# EasyEDA Pro project ProProject_ReuleauxTriangle_2023-12-01.epro

# Schematic Schematic1
Create Date: 2023-11-23; Page Name: P1; Project Name: ReuleauxTriangle; Schematic Name: Schematic1; Update Date: 2023-11-29; Company: 嘉立创EDA; Page Size: A4; Version: V1.0
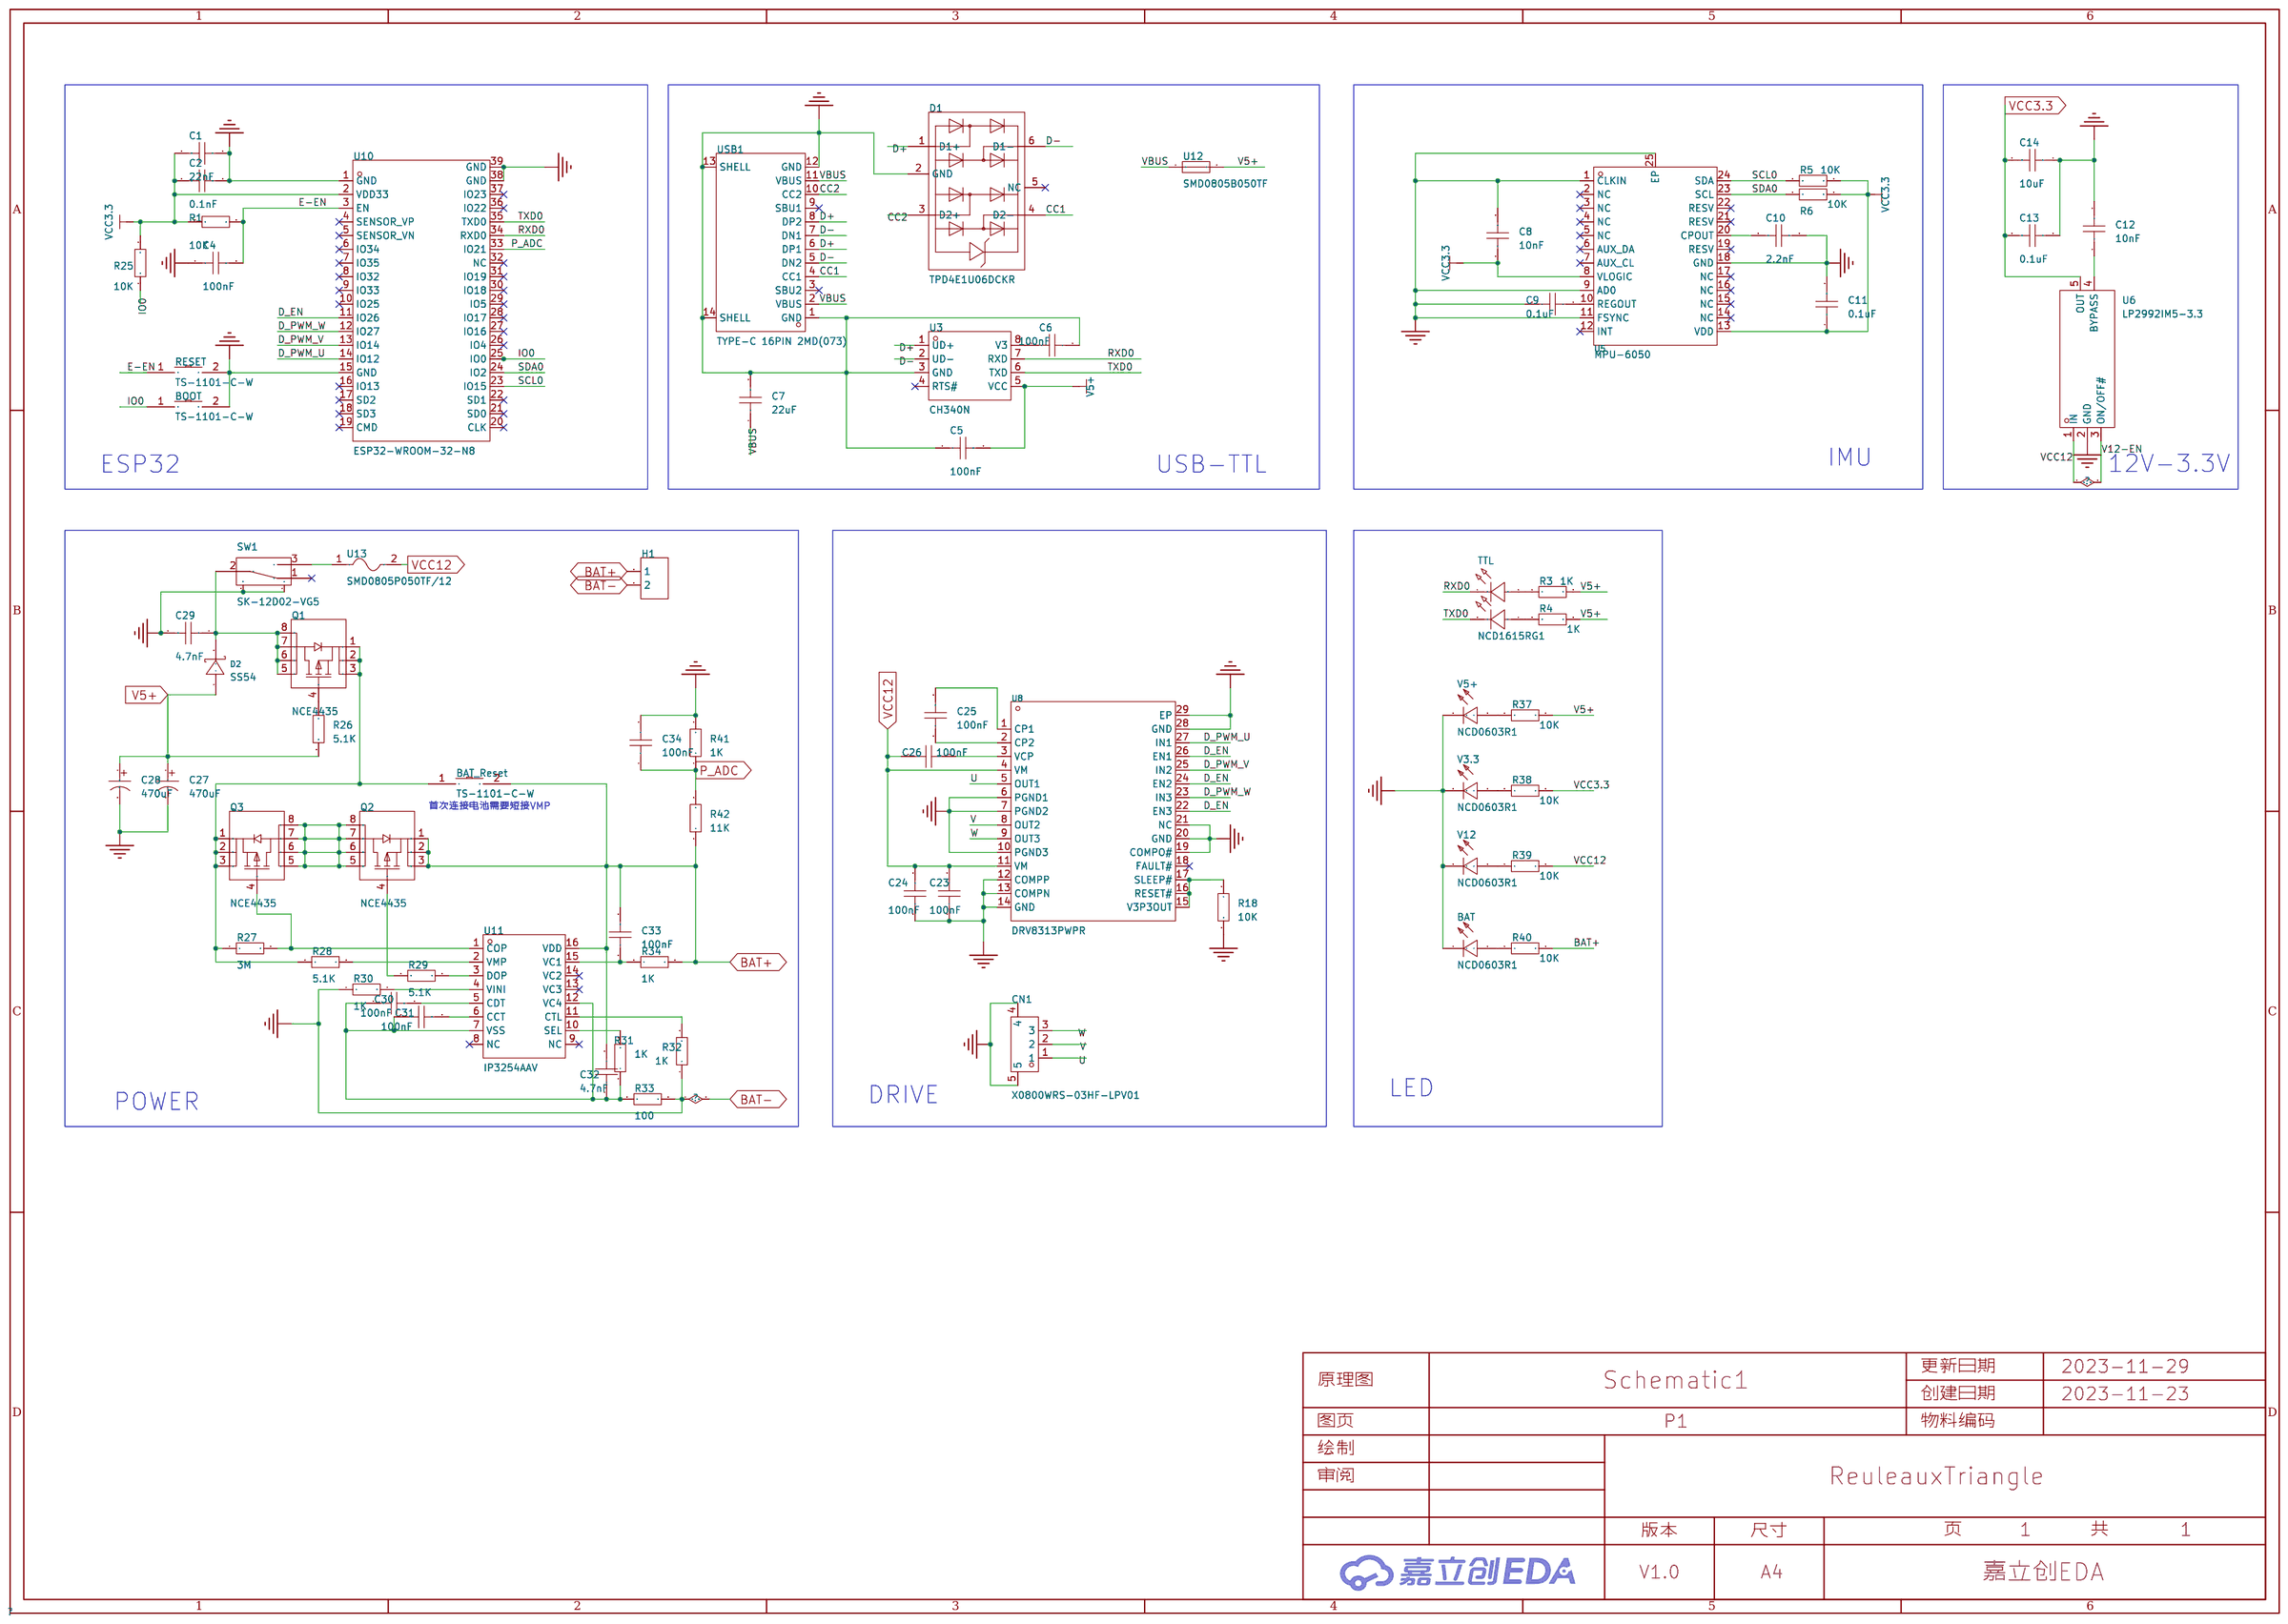
[diagram p0: schematic sheet]

## Parts
BAT  NCD0603R1  [LED0603-RD_RED]
BAT_Reset  TS-1101-C-W  [SW-SMD_L6.0-W3.3-LS8.0]
BOOT  TS-1101-C-W  [SW-SMD_L6.0-W3.3-LS8.0]
C1  22nF  [C0402]
C2  0.1nF  [C0402]
C4  100nF  [C0402]
C5  100nF  [C0402]
C6  100nF  [C0402]
C7  22uF  [C0402]
C8  10nF  [C0402]
C9  0.1uF  [C0402]
C10  2.2nF  [C0402]
C11  0.1uF  [C0402]
C12  10nF  [C0402]
C13  0.1uF  [C0402]
C14  10uF  [C0402]
C23  100nF  [C0402]
C24  100nF  [C0402]
C25  100nF  [C0402]
C26  100nF  [C0402]
C27  470uF  [CAP-SMD_BD10.0-L10.3-W10.3-FD]
C28  470uF  [CAP-SMD_BD10.0-L10.3-W10.3-FD]
C29  4.7nF  [C0402]
C30  100nF  [C0402]
C31  100nF  [C0402]
C32  4.7nF  [C0402]
C33  100nF  [C0402]
C34  100nF  [C0402]
CN1  X0800WRS-03HF-LPV01  [CONN-SMD_X0800WRS-03HF-LPV01]
D1  TPD4E1U06DCKR  [SC-70-6_L2.2-W1.3-P0.65-LS2.1-BL]
D2  SS54  [SMA_L4.4-W2.8-LS5.4-R-RD]
H1  -  [HDR-TH_2P-P2.54-V-F]
Q1  NCE4435  [SOP-8_L5.0-W4.0-P1.27-LS6.2-BL]
Q2  NCE4435  [SOP-8_L5.0-W4.0-P1.27-LS6.2-BL]
Q3  NCE4435  [SOP-8_L5.0-W4.0-P1.27-LS6.2-BL]
R1  10K  [R0402]
R3  1K  [R0402]
R4  1K  [R0402]
R5  10K  [R0402]
R6  10K  [R0402]
R18  10K  [R0402]
R25  10K  [R0402]
R26  5.1K  [R0402]
R27  3M  [R0402]
R28  5.1K  [R0402]
R29  5.1K  [R0402]
R30  1K  [R0402]
R31  1K  [R0402]
R32  1K  [R0402]
R33  100  [R0402]
R34  1K  [R0402]
R37  10K  [R0402]
R38  10K  [R0402]
R39  10K  [R0402]
R40  10K  [R0402]
R41  1K  [R0402]
R42  11K  [R0402]
RESET  TS-1101-C-W  [SW-SMD_L6.0-W3.3-LS8.0]
SW1  SK-12D02-VG5  [SW-TH_SK-12D02-VG5]
TTL  NCD1615RG1  [LED-SMD_4P-L1.6-W1.5-TL-1]
U3  CH340N  [SOP-8_L4.9-W3.9-P1.27-LS6.0-BL]
U5  MPU-6050  [QFN-24_L4.0-W4.0-P0.50-BL-EP2.7]
U6  LP2992IM5-3.3  [SOT-23-5_L2.9-W1.6-P0.95-LS2.8-BL]
U8  DRV8313PWPR  [HTSSOP-28_L9.8-W4.5-P0.65-LS6.6-BL-EP]
U10  ESP32-WROOM-32-N8  [WIFIM-SMD_39P-L25.5-W18.0-P1.27]
U11  IP3254AAV  [TSSOP-16_L5.0-W4.4-P0.65-LS6.4-BL]
U12  SMD0805B050TF  [F0805]
U13  SMD0805P050TF/12  [F0805]
USB1  TYPE-C 16PIN 2MD(073)  [USB-C-SMD_TYPE-C-6PIN-2MD-073]
V3.3  NCD0603R1  [LED0603-RD_RED]
V5+  NCD0603R1  [LED0603-RD_RED]
V12  NCD0603R1  [LED0603-RD_RED]

## Library data of the parts
BAT V3.3 V5+ V12 = NCD0603R1_C84263: 发光颜色:红色;功率:65mW;透镜颜色:无色透明;主波长:615nm~630nm;发光强度:80mcd~220mcd;发光角度:130°;工作温度:-30℃~+85℃;; LCSC Part Name: 红灯 0603红灯   正贴; Supplier Part: C84263; Manufacturer: 国星光电; Supplier Footprint: 0603; JLCPCB Part Class: Extended Part; Datasheet: https://atta.szlcsc.com/upload/public/pdf/source/20200820/C84263_DABC6A75E58F576973B407FDBA283D60.pdf; Supplier: LCSC; Emitted Color: 红色; Forward Voltage (VF): 1.6V~2.6V; Forward Current: 20mA; Power Dissipation: 65mW; Lens Color: 无色透明; Dominant Wavelength: 615nm~630nm; Luminous Intensity: 80mcd~220mcd; Viewing Angle: 130°; Operating Temperature: -30℃~+85℃
BAT_Reset BOOT RESET = TS-1101-C-W: 电路结构:单刀单掷;带支架:否;触点电流:50mA;额定电压(AC):-;额定电压(DC):12V;额定功率:-;安装方式:立贴;绝缘电阻:-;带灯:无;作用力:260gf;机械寿命:5万次;; LCSC Part Name: 6*3.6*2.5mm 立贴 轻触开关 白色带淡绿按键 卷装; Supplier Part: C318938; Manufacturer: XKB Connectivity(中国星坤); Supplier Footprint: SMD; JLCPCB Part Class: Extended Part; Datasheet: https://atta.szlcsc.com/upload/public/pdf/source/20200227/C318938_C2E53B1EEDE37D980A33616AC086DE53.pdf; Supplier: LCSC; Circuit: 单刀单掷; Actuator Style: 矩形按钮; Switch Length: 6mm; Switch Width: 3.6mm; Switch Height: 2.5mm; Strike Gundam: 否; Contact Current: 50mA; Voltage Rating (DC): 12V; Mounting Style: 立贴; Actuator/Cap Color: 白色带淡绿; With Lamp: 无; Operating Force: 260gf; Mechanical Life: 5万次; Operating Temperature: -30℃~+85℃
C1 C2 C4-C14 C23-C26 C29-C34 = CAP_0402: Supplier Footprint: 0402
C27 C28 = RVT1V471M1010: 容值:470uF;精度:±20%;额定电压:35V;纹波电流:-;等效串联电阻:-;; LCSC Part Name: 470uF ±20% 35V; Supplier Part: C3350; Manufacturer: HONOR(荣誉); Supplier Footprint: SMD,D10xL10.2mm; JLCPCB Part Class: Extended Part; Datasheet: https://atta.szlcsc.com/upload/public/pdf/source/20210521/C113284_25C86AE95FB541053FE695F13EA8E7D0.pdf; Supplier: LCSC; Tolerance: ±20%; Rated Voltage: 35V; φD: 10mm; L: 10.2mm; Lifetime @ Temp: 2000hrs@105℃; Operating Temperature: -55℃~+105℃
CN1 = X0800WRS-03HF-LPV01: 参考系列:-;间距:0.8mm;插针结构:1x3P;排数:1;每排PIN数:3;行距:-;公母:公型插针;安装方式:卧贴;额定电流:500mA;触头材质:磷青铜;触头镀层:金;工作温度范围:-25℃~+85℃;焊接温度(最大值):260℃;; LCSC Part Name: 间距:0.8mm 1x3P 卧贴 镀金 替代JST; Supplier Part: C500138; Manufacturer: XKB Connectivity(中国星坤); Supplier Footprint: SMD,P=0.8mm; JLCPCB Part Class: Extended Part; Datasheet: https://atta.szlcsc.com/upload/public/pdf/source/20211011/3A0802A09DD608D3DCC2D13C156B7911.pdf; Supplier: LCSC; Pitch: 0.8mm; Pins Structure: 1x3P; Number of Rows: 1; Number of PINs Per Row: 3; Gender: 公型插针; Mounting Style: 卧贴; Current Rating (Max): 500mA; Contact Material: 磷青铜; Contact Plating: 金; Operating Temperature Range: -25℃~+85℃; Welding Temperature (Max): 260℃
D1 = TPD4E1U06DCKR: 极性:单向;反向截止电压(Vrwm):5.5V;击穿电压(VBR):6.5V;钳位电压(Vc)@Ipp:15V;; LCSC Part Name: 单向ESD; Supplier Part: C194628; Manufacturer: TI(德州仪器); Supplier Footprint: SOT-363; JLCPCB Part Class: Extended Part; Datasheet: https://atta.szlcsc.com/upload/public/pdf/source/20180625/C194628_A458CD25029D59CDC67787AEC4B36401.pdf; Supplier: LCSC; Polarity: 单向; Reverse Stand-Off Voltage (Vrwm): 5.5V; Breakdown Voltage (VBR): 6.5V; Peak Pulse Current(Ipp)@8/20us: 3A; Clamping Voltage@Ipp: 15V; Peak Pulse Power(Ppp)@8/20us: 45W; Operating Temperature: -40℃~+125℃@(Ta)
D2 = SS54_C22452: 直流反向耐压（Vr）:40V;平均整流电流（Io）:5A;正向压降（Vf）:550mV @ 5A;; Supplier Part: C22452; Manufacturer: MDD; Supplier Footprint: SMA(DO-214AC); JLCPCB Part Class: Basic Part; Supplier: LCSC
H1 = HDR-F_2.54_1x2P: Supplier Part: C49661; Supplier Footprint: 插件
Q1-Q3 = NCE4435: 类型:P沟道;漏源电压(Vdss):30V;连续漏极电流(Id):9.1A;功率(Pd):3.1W;导通电阻(RDS(on)@Vgs,Id):20mΩ@10V,9.1A;阈值电压(Vgs(th)@Id):3V@250uA;; LCSC Part Name: P沟道 30V 9.1A; Supplier Part: C95275; Manufacturer: NCE(无锡新洁能); Supplier Footprint: SOP-8; JLCPCB Part Class: 扩展库; Datasheet: https://atta.szlcsc.com/upload/public/pdf/source/20170211/1486785674640.pdf; Supplier: LCSC; Type: P沟道; Drain Source Voltage (Vdss): 30V; Continuous Drain Current (Id): 9.1A; Power Dissipation (Pd): 3.1W; Drain Source On Resistance (RDS(on)@Vgs,Id): 20mΩ@10V,9.1A; Gate Threshold Voltage (Vgs(th)@Id): 3V@250uA
R1 R3-R6 R18 R25-R34 R37-R42 = Res_0402: Supplier Footprint: 0402
SW1 = SK-12D02-VG5_C136722: 额定电流(DC):-;额定电压(DC):-;额定电流(AC):-;额定电压(AC):-;电路结构:单刀双掷;安装方式:卧插;机械寿命:5千次;; LCSC Part Name: 卧插双档 滑动开关; Supplier Part: C136722; Manufacturer: 韩国韩荣; Supplier Footprint: 插件; JLCPCB Part Class: 扩展库; Datasheet: https://atta.szlcsc.com/upload/public/pdf/source/20180731/C136723_39114FC09BF2E9DC98823B78B7234B45.pdf; Supplier: LCSC; Circuit: 单刀双掷; Mounting Style: 卧插; Mechanical Life: 5千次; Actuator Style: 矩形柱状; Pin Style: PC引脚; Operating Temperature: -25℃~+70℃; Switch Height: 9.5mm
TTL = NCD1615RG1: 发光颜色:橙红色,翠绿色;二极管配置:-;功率:72mW；52mW;透镜颜色:-;主波长:625nm；525nm;色温:-;发光强度:260mcd；150mcd;发光角度:130°;安装方式:-;工作温度:-30℃~+85℃;; LCSC Part Name: 红灯,翠绿 正贴 1615  双色LED; Supplier Part: C2917181; Manufacturer: 国星光电; Supplier Footprint: 0606; JLCPCB Part Class: Extended Part; Datasheet: https://atta.szlcsc.com/upload/public/pdf/source/20211124/E2F3DD35E9AE2C38D361CFFAAFF6A77F.pdf; Supplier: LCSC; Emitted Color: 橙红色,翠绿色; Forward Voltage (VF): 3.2V；2V; Forward Current: 20mA; Power Dissipation: 72mW；52mW; Dominant Wavelength: 625nm；525nm; Luminous Intensity: 260mcd；150mcd; Viewing Angle: 130°; Operating Temperature: -30℃~+85℃
U3 = CH340N: LCSC Part Name: USB转串口芯片 CH340; Supplier Part: C2977777; Manufacturer: WCH(南京沁恒); Supplier Footprint: SOP-8; JLCPCB Part Class: 扩展库; Datasheet: https://atta.szlcsc.com/upload/public/pdf/source/20230530/6E401E9554E9F5311886CC8B3F89B62E.pdf; Supplier: LCSC
U5 = MPU-6050: 三轴加速度计和三轴陀螺仪，工作电压：2.375V~3.46V; Supplier Part: C24112; Manufacturer: TDK InvenSense(应美盛); Supplier Footprint: QFN-24(4x4); JLCPCB Part Class: 扩展库; Datasheet: https://atta.szlcsc.com/upload/public/pdf/source/20140425/1457707046159.pdf; Supplier: LCSC
U6 = LP2992IM5-3.3: 输出类型:固定;输出极性:正;最大输入电压:16V;输出电压:3.3V;输出电流:250mA;电源纹波抑制比(PSRR):45dB@(1kHz);; Supplier Part: C3751592; Manufacturer: TI(德州仪器); Supplier Footprint: SOT-23-5; JLCPCB Part Class: 扩展库; Supplier: LCSC; Output Type: 固定; Output Polarity: 正; Number of Outputs: 1; Maximum Input Voltage: 16V; Output Voltage: 3.3V; Dropout Voltage: 850mV@(250mA); Quiescent Current (Ground Current): 95uA; Output Current: 250mA; Power Supply Rejection Ratio (PSRR): 45dB@(1kHz); Feature: 过流保护；过热保护; Operating Temperature: -40℃~+125℃@(Tj)
U8 = DRV8313PWPR: 类型:无刷直流BLDC;电源电压:8V~60V;输出电流:-;接口:并行;; LCSC Part Name: 无刷直流BLDC电机驱动芯片 60V; Supplier Part: C92482; Manufacturer: TI(德州仪器); Supplier Footprint: TSSOP-28-EP; JLCPCB Part Class: 扩展库; Datasheet: https://www.ti.com/cn/lit/gpn/drv8313; Supplier: LCSC; Type: 无刷直流BLDC; Supply Voltage: 8V~60V; Interface: 并行; Operating Temperature: -40℃~+150℃@(Tj)
U10 = ESP32-WROOM-32-N8: Supplier Part: C529582; Manufacturer: ESPRESSIF(乐鑫); Supplier Footprint: SMD,18x25.5mm; JLCPCB Part Class: Extended Part; Datasheet: https://atta.szlcsc.com/upload/public/pdf/source/20200521/C529581_8F7B9F041ADB7CF235FBC8D159B9C4FF.pdf; Supplier: LCSC
U11 = IP3254AAV: Supplier Part: C384569; Manufacturer: INJOINIC(英集芯); Supplier Footprint: TSSOP-16; JLCPCB Part Class: 扩展库; Datasheet: https://atta.szlcsc.com/upload/public/pdf/source/20190627/C384569_A25975C6DA0D38CB62CDBD6469AC3DAB.pdf; Supplier: LCSC
U12 = SMD0805B050TF: 最大电压:6V;最大电流:100A;保持电流:500mA;跳闸电流:1A;; LCSC Part Name: 6V 500mA 0805自恢复; Supplier Part: C269104; Manufacturer: Brightking(君耀电子); Supplier Footprint: 0805; JLCPCB Part Class: 扩展库; Datasheet: https://atta.szlcsc.com/upload/public/pdf/source/20180814/C269104_466839A5DB65F6E723CA6A162ACE747B.pdf; Supplier: LCSC; Operating Voltage (Max): 6V; Current Rating (Max): 100A; Hold Current: 500mA; Trip Current: 1A; Maximum Time to Trip: 100ms
U13 = SMD0805P050TF/12: 最大电压:12V;最大电流:100A;保持电流:500mA;跳闸电流:1A;; LCSC Part Name: 12V 500mA 0805自恢复; Supplier Part: C90129; Manufacturer: RUILON(瑞隆源); Supplier Footprint: 0805; JLCPCB Part Class: Extended Part; Datasheet: https://atta.szlcsc.com/upload/public/pdf/source/20180621/C90129_682C2B239333F36385CA0609A87C55A0.pdf; Supplier: LCSC; Operating Voltage (Max): 12V; Current Rating (Max): 100A; Hold Current: 500mA; Trip Current: 1A
USB1 = TYPE-C 16PIN 2MD(073): 连接器类型:Type-C;标准:-;公母:母;触点数量:16P;端口数量:1;安装方式:卧贴;额定电流 - 电源:5A;工作温度范围:-25℃~+85℃;; LCSC Part Name: Type-C 母 卧贴 带定位柱 不锈钢外壳 2次模顶; Supplier Part: C2765186; Manufacturer: SHOU HAN(首韩); Supplier Footprint: SMD; JLCPCB Part Class: 扩展库; Datasheet: https://atta.szlcsc.com/upload/public/pdf/source/20211123/39B17C16241EAC15C5E277BDA434118E.pdf; Supplier: LCSC; Connector Type: Type-C; Gender: 母; Number of Contacts: 16P; Number of Ports: 1; Mounting Style: 卧贴; Current Rating - Power (Max): 5A; Operating Temperature Range: -25℃~+85℃

## Nets
GND: BAT.1(K) BOOT.2 C1.1 C2.2 C4.1 C5.1 C6.2 C7.2 C8.2 C9.1 C10.2 C11.2 C12.2 C13.1 C14.1 C23.1 C24.1 C27.2 C28.2 C29.2 C34.2 CN1.4 CN1.5 D1.2(GND) H1.2 R18.2 R30.1 R32.1 R33.2 R41.2 RESET.2 SW1.4 SW1.5 U3.3(GND) U5.1(CLKIN) U5.9(AD0) U5.11(FSYNC) U5.18(GND) U5.25(EP) U6.2(GND) U8.6(PGND1) U8.7(PGND2) U8.10(PGND3) U8.12(COMPP) U8.13(COMPN) U8.14(GND) U8.19(COMPO#) U8.20(GND) U8.21(NC) U8.28(GND) U8.29(EP) U10.1(GND) U10.15(GND) U10.38(GND) U10.39(GND) USB1.1(GND) USB1.12(GND) USB1.13(SHELL) USB1.14(SHELL) V3.3.1(K) V5+.1(K) V12.1(K)
V5+: C5.2 C27.1 C28.1 D2.1(A) R3.2 R4.2 R26.2 R37.2 U3.5(VCC) U12.2
V12-EN: C23.2 C24.2 C26.1 R39.2 U6.1(IN) U6.3(ON/OFF#) U8.4(VM) U8.11(VM) U13.2
VBUS: C7.1 U12.1 USB1.2(VBUS) USB1.11(VBUS)
VCC3.3: C1.2 C2.1 C8.1 C11.1 C13.2 C14.2 R1.1 R5.2 R6.2 R25.2 R38.2 U5.8(VLOGIC) U5.13(VDD) U6.5(OUT) U10.2(VDD33)
BAT+: BAT_Reset.2 C32.2 C33.2 H1.1 Q2.1(S) Q2.2(S) Q2.3(S) R34.2 R40.2 R42.1 U11.16(VDD)
CC1: D1.4(D2-) USB1.4(CC1)
CC2: D1.3(D2+) USB1.10(CC2)
D+: D1.1(D1+) U3.1(UD+) USB1.6(DP1) USB1.8(DP2)
D-: D1.6(D1-) U3.2(UD-) USB1.5(DN2) USB1.7(DN1)
D_EN: U8.22(EN3) U8.24(EN2) U8.26(EN1) U10.11(IO26)
D_PWM_U: U8.27(IN1) U10.14(IO12)
D_PWM_V: U8.25(IN2) U10.13(IO14)
D_PWM_W: U8.23(IN3) U10.12(IO27)
E-EN: C4.2 R1.2 RESET.1 U10.3(EN)
IO0: BOOT.1 R25.1 U10.25(IO0)
P_ADC: C34.1 R41.1 R42.2 U10.33(IO21)
RXD0: TTL.1(R-) U3.7(RXD) U10.34(RXD0)
SCL0: R5.1 U5.24(SDA) U10.23(IO15)
SDA0: R6.1 U5.23(SCL) U10.24(IO2)
TXD0: TTL.3(UG-) U3.6(TXD) U10.35(TXD0)
U: CN1.1 U8.5(OUT1)
V: CN1.2 U8.8(OUT2)
W: CN1.3 U8.9(OUT3)
$1N4426: C6.1 U3.8(V3)
$1N4742: R3.1 TTL.2(+R)
$1N4768: R4.1 TTL.4(+UG)
$1N6012: C9.2 U5.10(REGOUT)
$1N6344: C10.1 U5.20(CPOUT)
$1N6735: C12.1 U6.4(BYPASS)
$1N10947: R18.1 U8.15(V3P3OUT) U8.16(RESET#) U8.17(SLEEP#)
$1N11170: C25.2 U8.1(CP1)
$1N11174: C25.1 U8.2(CP2)
$1N11246: C26.2 U8.3(VCP)
$1N21068: Q1.4(G) R26.1
$1N21616: Q2.5(D) Q2.6(D) Q2.7(D) Q2.8(D) Q3.5(D) Q3.6(D) Q3.7(D) Q3.8(D)
$1N22205: Q2.4(G) R29.1
$1N22284: R28.2 U11.2(VMP)
$1N22287: R29.2 U11.3(DOP)
$1N22338: R30.2 U11.4(VINI)
$1N22413: C30.2 U11.5(CDT)
$1N22416: C31.2 U11.6(CCT)
$1N22526: R31.2 U11.10(SEL)
$1N22587: R32.2 U11.11(CTL)
$1N22677: C30.1 C31.1 C32.1 R31.1 R33.1 U11.7(VSS) U11.12(VC4)
$1N22806: C33.1 R34.1 U11.15(VC1)
$1N23187: BAT_Reset.1 Q1.1(S) Q1.2(S) Q1.3(S) Q3.1(S) Q3.2(S) Q3.3(S) R27.1 R28.1
$1N23372: C29.1 D2.2(K) Q1.5(D) Q1.6(D) Q1.7(D) Q1.8(D) SW1.2
$1N23637: Q3.4(G) R27.2 U11.1(COP)
$1N23749: R37.1 V5+.2(A)
$1N23775: R38.1 V3.3.2(A)
$1N23930: R39.1 V12.2(A)
$1N24036: BAT.2(A) R40.1
$1N25830: SW1.3 U13.1

Not connected (* = marked no-connect by the designer): D1 5(NC)*; SW1 1*; U3 4(RTS#)*; U5 2(NC)* 3(NC)* 4(NC)* 5(NC)* 6(AUX_DA)* 7(AUX_CL)* 12(INT)* 14(NC)* 15(NC)* 16(NC)* 17(NC)* 19(RESV)* 21(RESV)* 22(RESV)*; U8 18(FAULT#)*; U10 4(SENSOR_VP)* 5(SENSOR_VN)* 6(IO34)* 7(IO35)* 8(IO32)* 9(IO33)* 10(IO25)* 16(IO13)* 17(SD2)* 18(SD3)* 19(CMD)* 20(CLK)* 21(SD0)* 22(SD1)* 26(IO4)* 27(IO16)* 28(IO17)* 29(IO5)* 30(IO18)* 31(IO19)* 32(NC)* 36(IO22)* 37(IO23)*; U11 8(NC)* 9(NC)* 13(VC3)* 14(VC2)*; USB1 3(SBU2)* 9(SBU1)*

## Notes on the sheet
- IMU
- 12V-3.3V
- ESP32
- USB-TTL
- 首次连接电池需要短接VMP
- LED
- POWER
- DRIVE

# Board PCB4
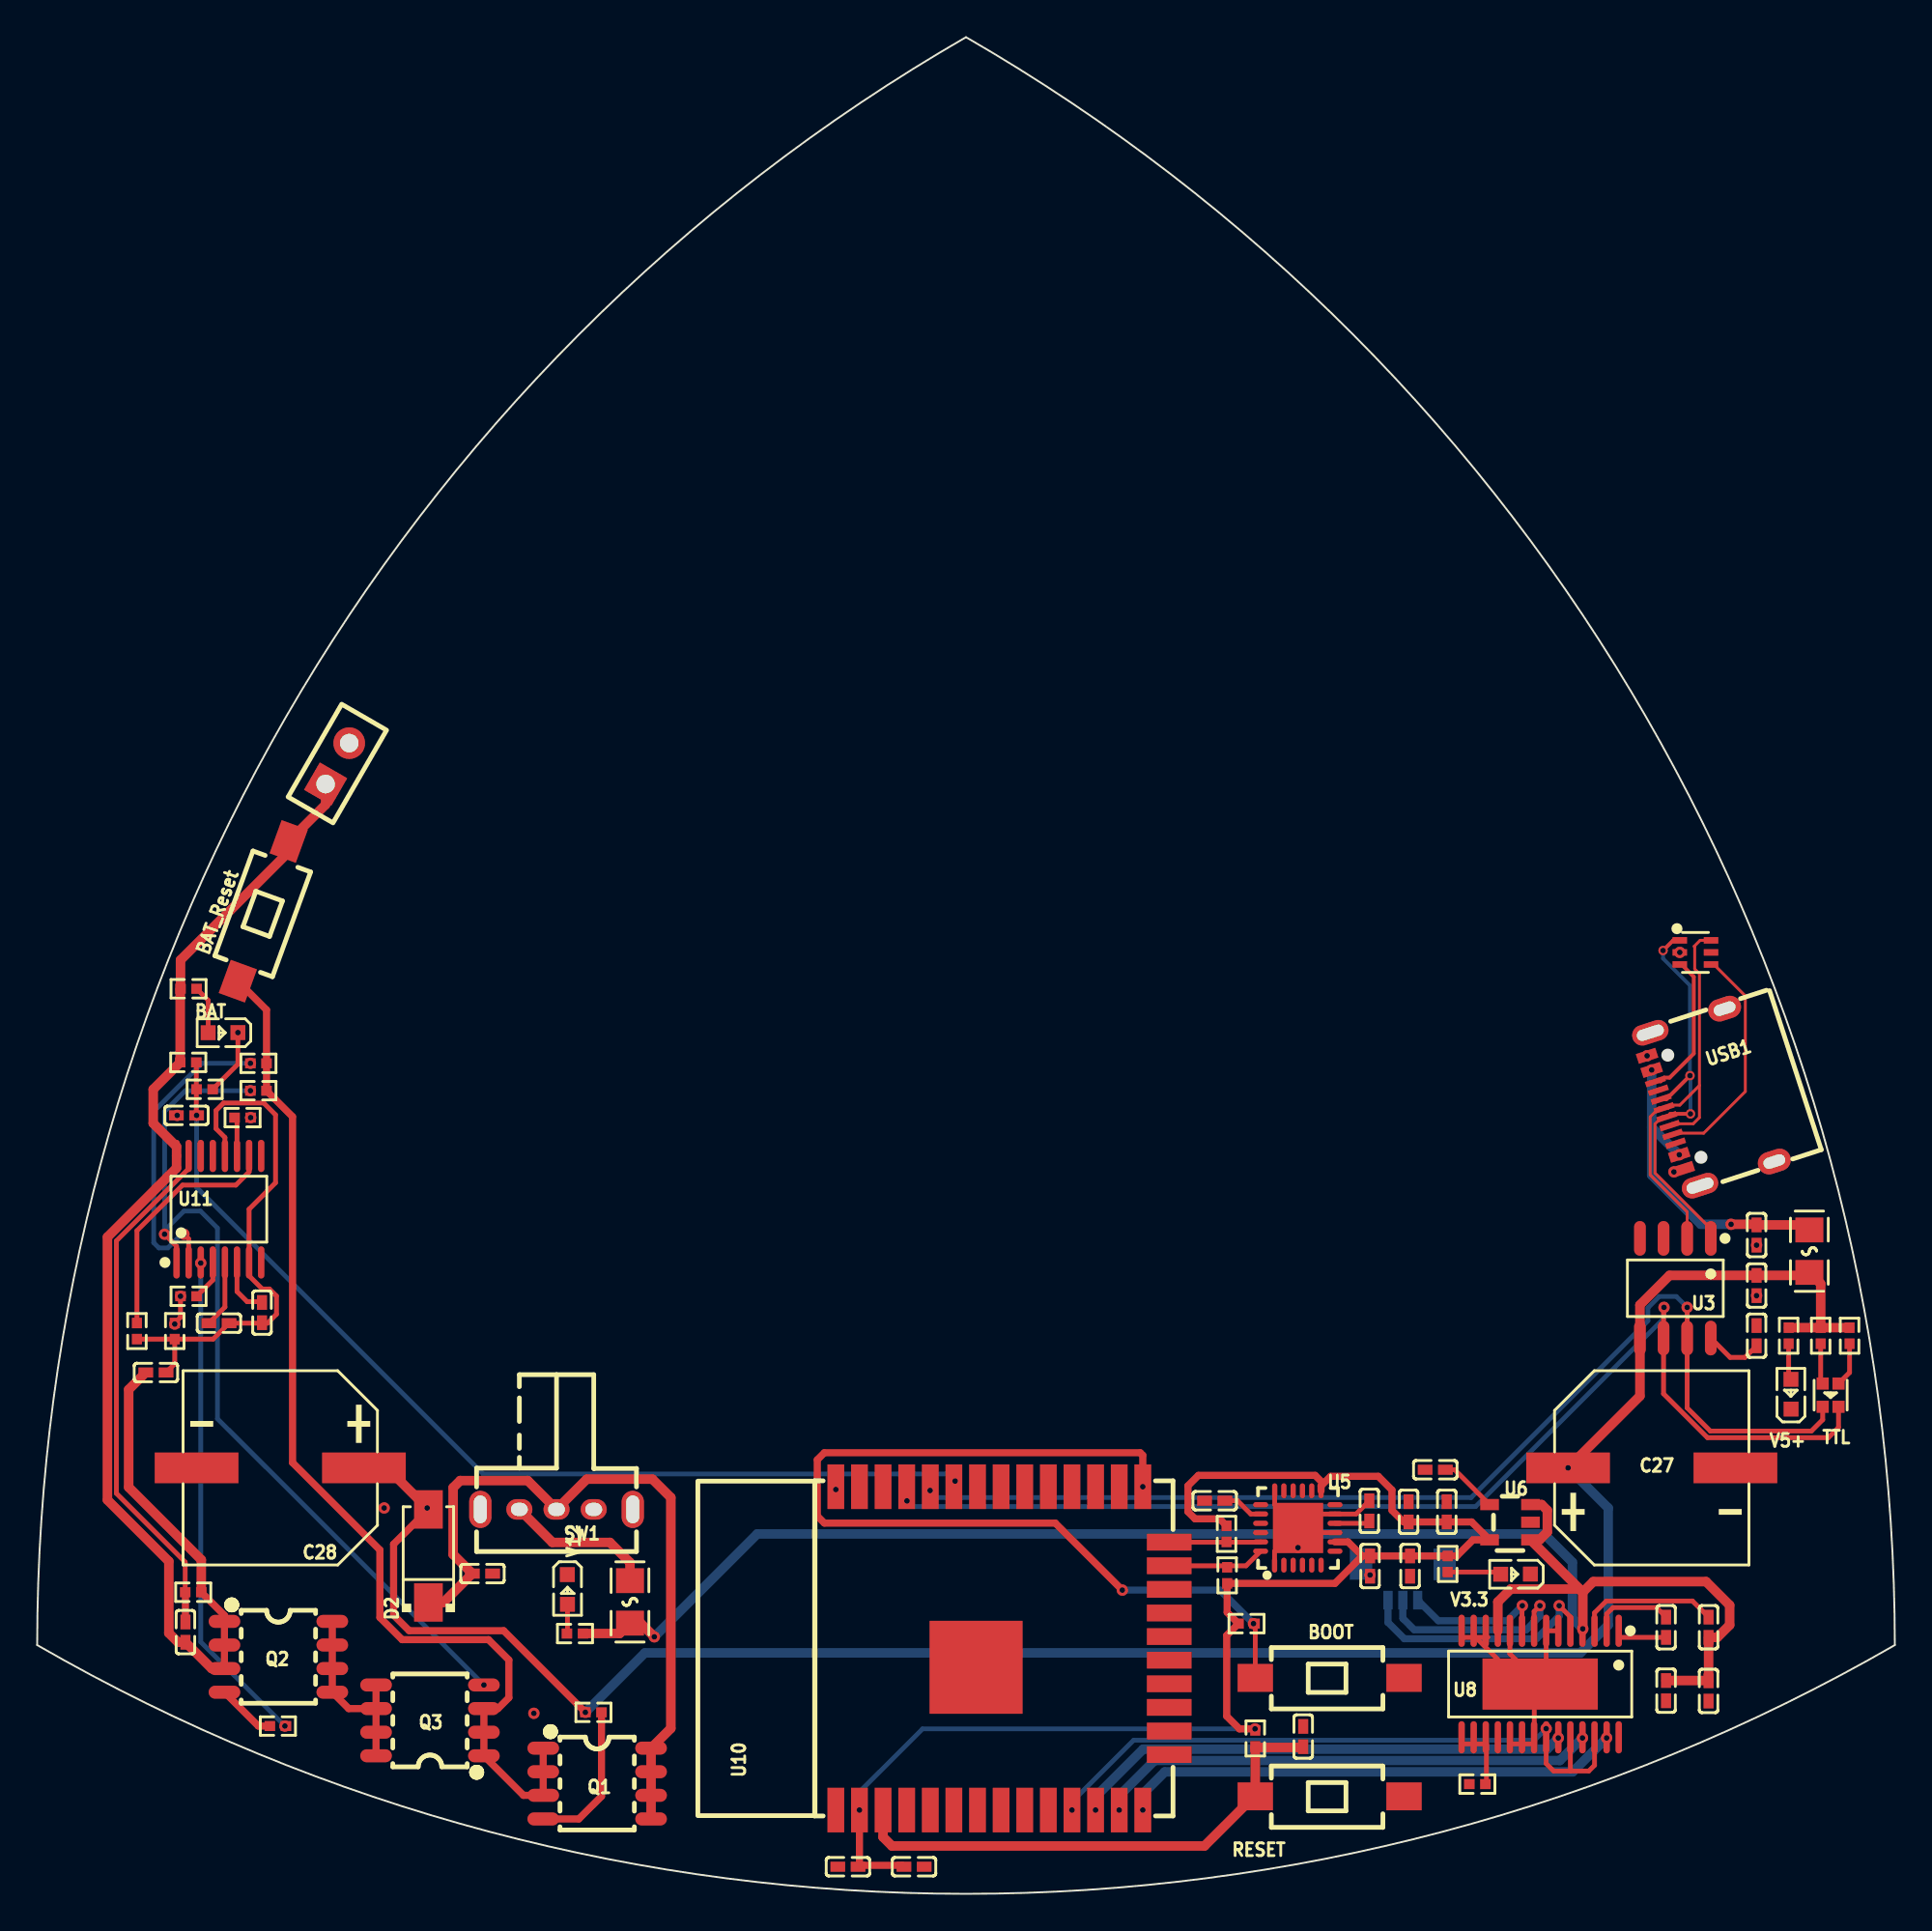
[diagram p1: board, top side]
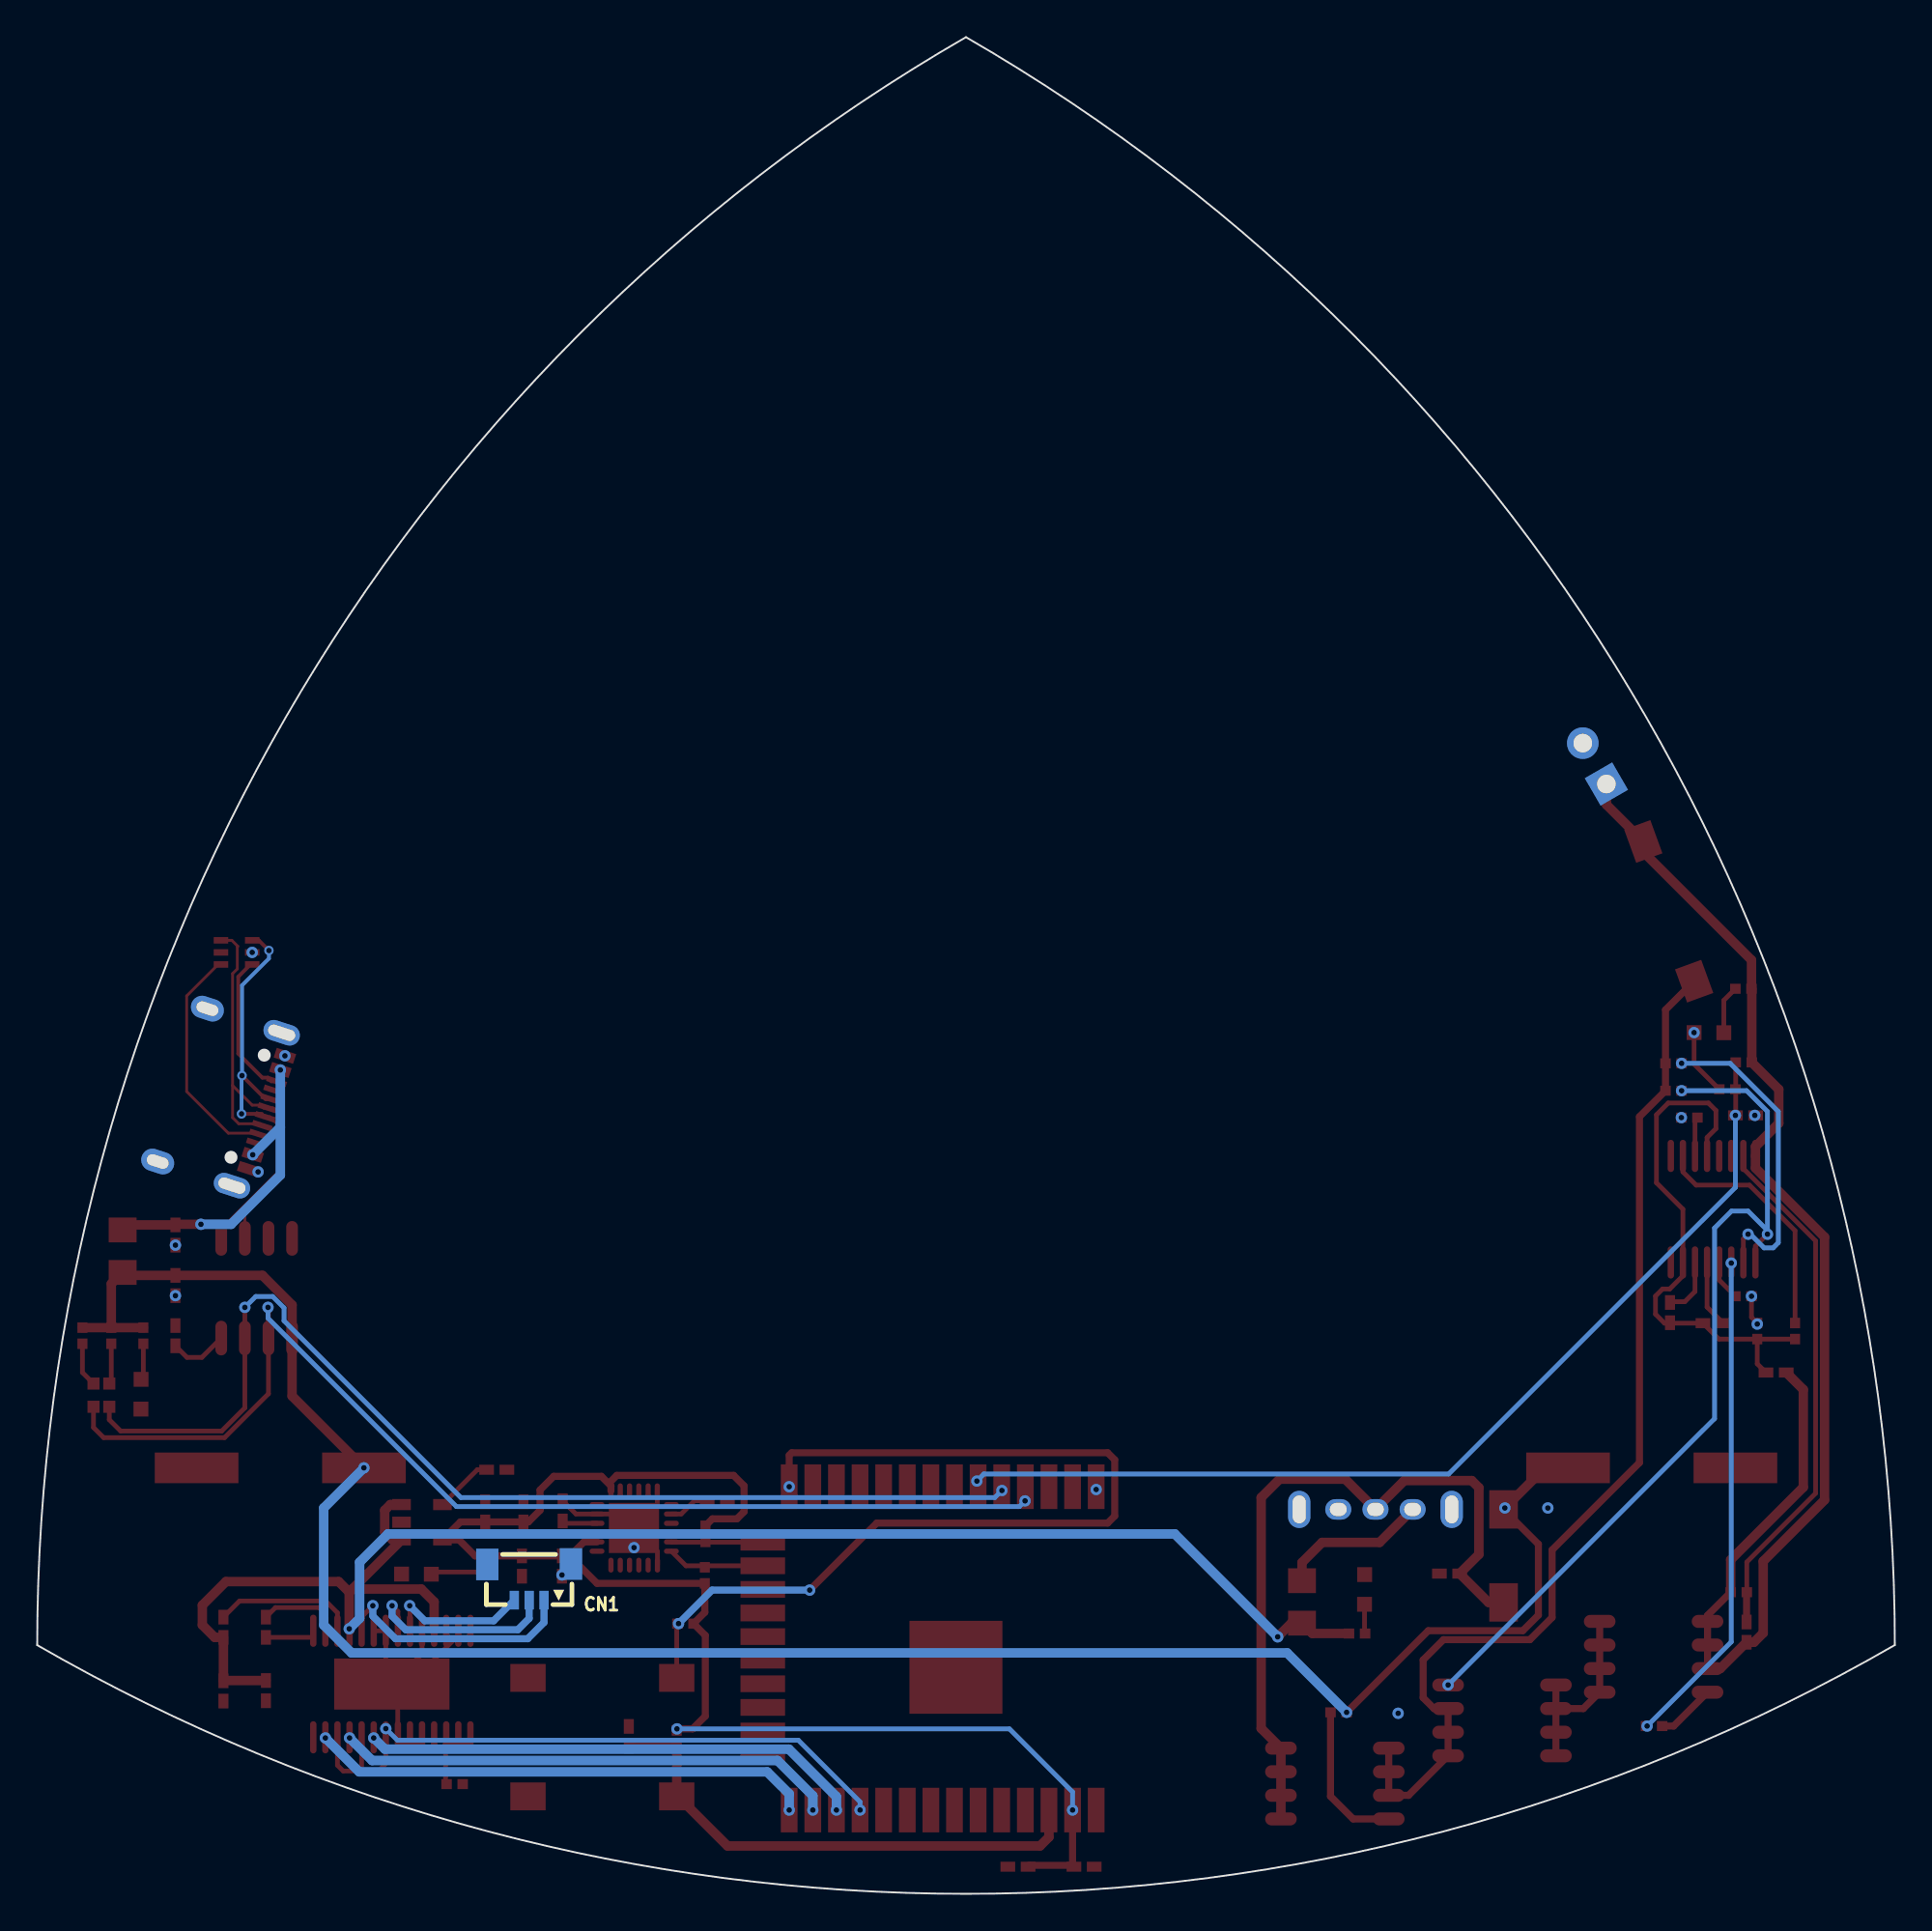
[diagram p2: board, bottom side, seen from below]

Outline 99.91 x 99.91 mm; copper layers: Top Layer, Bottom Layer. Coordinates in mm from the lower left corner of the outline.
Outline path: 0,13.39 arc(13.39,63.34) 49.95,99.91 arc(86.52,63.34) 99.91,13.39 arc(49.95,0) 0,13.39
Stack: Top Layer 0.035mm / Dielectric1 1.51mm FR4 er 4.5 / Bottom Layer 0.035mm

## Design rules (mm)
template: 自定义配置
spacing copperThickness1oz (default): track to track 0.102, other pairs 0 to 0.3
spacing copperThickness2oz: track to track 0.203, other pairs 0.152 to 0.3
track width copperThickness1oz (default): min 0.127, default 0.254, max 2.54
track width copperThickness2oz: min 0.203, default 0.254, max 2.54
differential pair differentialPair (default): width min 0.127, default 0.254, max 2.54; gap min 0.152, default 0.152
via viaSize (default): diameter min 0.5, default 0.61, max 10; hole min 0.3, default 0.305, max 6.3

## Placement (name value [footprint] x y rotation side)
BAT  NCD0603R1  [LED0603-RD_RED]  10 46.34 180 top
BAT_Reset  TS-1101-C-W  [SW-SMD_L6.0-W3.3-LS8.0]  12.16 52.87 70 top
BOOT  TS-1101-C-W  [SW-SMD_L6.0-W3.3-LS8.0]  69.51 11.62 0 top
C1  22nF  [C0402]  43.6 1.46 0 top
C2  0.1nF  [C0402]  47.16 1.46 0 top
C4  100nF  [C0402]  68.09 8.46 270 top
C5  100nF  [C0402]  92.47 32.73 90 top
C6  100nF  [C0402]  92.47 30.03 90 top
C7  22uF  [C0402]  92.47 35.45 270 top
C8  10nF  [C0402]  73.84 17.64 270 top
C9  0.1uF  [C0402]  71.65 20.61 270 top
C10  2.2nF  [C0402]  63.33 21.15 180 top
C11  0.1uF  [C0402]  71.68 17.64 270 top
C12  10nF  [C0402]  75.19 22.82 180 top
C13  0.1uF  [C0402]  75.81 20.56 270 top
C14  10uF  [C0402]  73.76 20.56 270 top
C23  100nF  [C0402]  89.89 10.92 90 top
C24  100nF  [C0402]  87.61 10.93 90 top
C25  100nF  [C0402]  87.61 14.34 270 top
C26  100nF  [C0402]  89.89 14.34 90 top
C27  470uF  [CAP-SMD_BD10.0-L10.3-W10.3-FD]  86.84 22.92 0 top
C28  470uF  [CAP-SMD_BD10.0-L10.3-W10.3-FD]  13.07 22.92 180 top
C29  4.7nF  [C0402]  23.95 17.23 0 top
C30  100nF  [C0402]  9.78 30.71 180 top
C31  100nF  [C0402]  12.09 31.28 90 top
C32  4.7nF  [C0402]  6.38 28.05 180 top
C33  100nF  [C0402]  7.97 14.08 270 top
C34  100nF  [C0402]  8.03 41.89 180 top
CN1  X0800WRS-03HF-LPV01  [CONN-SMD_X0800WRS-03HF-LPV01]  73.45 16.78 0 bottom
D1  TPD4E1U06DCKR  [SC-70-6_L2.2-W1.3-P0.65-LS2.1-BL]  89.18 50.66 270 top
D2  SS54  [SMA_L4.4-W2.8-LS5.4-R-RD]  21.04 18.18 90 top
H1  -  [HDR-TH_2P-P2.54-V-F]  16.15 60.82 60 top
Q1  NCE4435  [SOP-8_L5.0-W4.0-P1.27-LS6.2-BL]  30.12 5.93 270 top
Q2  NCE4435  [SOP-8_L5.0-W4.0-P1.27-LS6.2-BL]  12.97 12.76 270 top
Q3  NCE4435  [SOP-8_L5.0-W4.0-P1.27-LS6.2-BL]  21.13 9.33 90 top
R1  10K  [R0402]  65.51 8.36 270 top
R3  1K  [R0402]  95.92 30.03 90 top
R4  1K  [R0402]  97.48 30.03 90 top
R5  10K  [R0402]  64 17.14 270 top
R6  10K  [R0402]  63.97 19.37 90 top
R18  10K  [R0402]  77.46 5.9 180 top
R25  10K  [R0402]  65.04 14.54 180 top
R26  5.1K  [R0402]  29.92 9.77 180 top
R27  3M  [R0402]  11.9 43.22 180 top
R28  5.1K  [R0402]  11.9 44.69 180 top
R29  5.1K  [R0402]  12.95 9.03 0 top
R30  1K  [R0402]  8.14 32.16 0 top
R31  1K  [R0402]  5.36 30.28 90 top
R32  1K  [R0402]  11.05 41.77 180 top
R33  100  [R0402]  7.4 30.28 90 top
R34  1K  [R0402]  8.39 16.23 0 top
R37  10K  [R0402]  94.2 30.03 90 top
R38  10K  [R0402]  75.86 17.75 90 top
R39  10K  [R0402]  28.92 14.01 0 top
R40  10K  [R0402]  8.14 48.7 180 top
R41  1K  [R0402]  9.01 43.29 0 top
R42  11K  [R0402]  8.12 44.74 0 top
RESET  TS-1101-C-W  [SW-SMD_L6.0-W3.3-LS8.0]  69.51 5.24 0 top
SW1  SK-12D02-VG5  [SW-TH_SK-12D02-VG5]  27.93 20.69 180 top
TTL  NCD1615RG1  [LED-SMD_4P-L1.6-W1.5-TL-1]  96.46 26.83 90 top
U3  CH340N  [SOP-8_L4.9-W3.9-P1.27-LS6.0-BL]  88.11 32.59 180 top
U5  MPU-6050  [QFN-24_L4.0-W4.0-P0.50-BL-EP2.7]  67.8 19.69 0 top
U6  LP2992IM5-3.3  [SOT-23-5_L2.9-W1.6-P0.95-LS2.8-BL]  79.21 20 90 top
U8  DRV8313PWPR  [HTSSOP-28_L9.8-W4.5-P0.65-LS6.6-BL-EP]  80.83 11.29 180 top
U10  ESP32-WROOM-32-N8  [WIFIM-SMD_39P-L25.5-W18.0-P1.27]  51.92 13.21 90 top
U11  IP3254AAV  [TSSOP-16_L5.0-W4.4-P0.65-LS6.4-BL]  9.77 36.84 0 top
U12  SMD0805B050TF  [F0805]  95.31 34.58 270 top
U13  SMD0805P050TF/12  [F0805]  31.88 15.71 270 top
USB1  TYPE-C 16PIN 2MD(073)  [USB-C-SMD_TYPE-C-6PIN-2MD-073]  89.83 42.79 108 top
V3.3  NCD0603R1  [LED0603-RD_RED]  79.51 17.2 180 top
V5+  NCD0603R1  [LED0603-RD_RED]  94.33 26.88 90 top
V12  NCD0603R1  [LED0603-RD_RED]  28.52 16.38 270 top

## Footprints (pads in the part's own frame, mm; a bottom-side part is the same pattern mirrored in y, then rotated)
C0402
  rect 0.79x0.54 smd: 1(-0.545,0) 2(0.545,0)
CAP-SMD_BD10.0-L10.3-W10.3-FD
  rect 4.5x1.65 smd: 1(-4.5,0) 2(4.5,0)
CONN-SMD_X0800WRS-03HF-LPV01
  rect 0.5x1 smd: 1(-0.8,0.973) 2(0,0.973) 3(0.8,0.973)
  rect 1.2x1.7 smd: 4(2.25,-0.95) 5(-2.25,-0.973)
F0805
  rect 1.335x1.5 smd: 1(-1.143,0) 2(1.143,0)
HDR-TH_2P-P2.54-V-F
  rect 1.7x1.7 hole 1: 1(-1.27,0)
  round 1.7 hole 1: 2(1.27,0)
HTSSOP-28_L9.8-W4.5-P0.65-LS6.6-BL-EP
  oval 0.343x1.732 smd: 1(-4.225,-2.866) 2(-3.575,-2.866) 3(-2.925,-2.866) 4(-2.275,-2.866) 5(-1.625,-2.866) 6(-0.975,-2.866) 7(-0.325,-2.866) 8(0.325,-2.866) 9(0.975,-2.866) 10(1.625,-2.866) 11(2.275,-2.866) 12(2.925,-2.866) 13(3.575,-2.866) 14(4.225,-2.866) 15(4.225,2.866) 16(3.575,2.866) 17(2.925,2.866) 18(2.275,2.866) 19(1.625,2.866) 20(0.975,2.866) 21(0.325,2.866) 22(-0.325,2.866) 23(-0.975,2.866) 24(-1.625,2.866) 25(-2.275,2.866) 26(-2.925,2.866) 27(-3.575,2.866) 28(-4.225,2.866)
  rect 6.2x2.75 smd: 29(0,0)
LED0603-RD_RED
  rect 0.8x0.8 smd: 1(-0.799,-0.004) 2(0.799,0.004)
LED-SMD_4P-L1.6-W1.5-TL-1
  rect 0.65x0.65 smd: 1(-0.625,0.425) 2(0.625,0.425) 3(-0.625,-0.425) 4(0.625,-0.425)
QFN-24_L4.0-W4.0-P0.50-BL-EP2.7
  oval 0.28x0.8 smd: 1(-1.25,-2) 2(-0.75,-2) 3(-0.25,-2) 4(0.25,-2) 5(0.75,-2) 6(1.25,-2) 13(1.25,2) 14(0.75,2) 15(0.25,2) 16(-0.25,2) 17(-0.75,2) 18(-1.242,2)
  oval 0.8x0.28 smd: 7(2,-1.25) 8(2,-0.75) 9(2,-0.25) 10(2,0.25) 11(2,0.75) 12(2,1.25) 19(-2,1.25) 20(-2,0.75) 21(-2,0.25) 22(-2,-0.25) 23(-2,-0.75) 24(-2,-1.25)
  rect 2.7x2.7 smd: 25(0.013,0)
R0402
  rect 0.566x0.54 smd: 1(-0.433,0) 2(0.433,0)
SC-70-6_L2.2-W1.3-P0.65-LS2.1-BL
  rect 0.35x0.78 smd: 1(-0.65,-0.84) 2(0,-0.84) 3(0.65,-0.84) 4(0.65,0.84) 5(0,0.84) 6(-0.65,0.84)
SMA_L4.4-W2.8-LS5.4-R-RD
  rect 2.062x1.539 smd: 1(2.503,0) 2(-2.503,0)
SOP-8_L4.9-W3.9-P1.27-LS6.0-BL
  oval 0.63x1.865 smd: 1(-1.905,-2.683) 2(-0.635,-2.683) 3(0.635,-2.683) 4(1.905,-2.683) 5(1.905,2.683) 6(0.635,2.683) 7(-0.635,2.683) 8(-1.905,2.683)
SOP-8_L5.0-W4.0-P1.27-LS6.2-BL
  oval 0.7x1.7 smd: 1(-1.905,-2.9) 2(-0.635,-2.9) 3(0.635,-2.9) 4(1.905,-2.9) 5(1.905,2.9) 6(0.635,2.9) 7(-0.635,2.9) 8(-1.905,2.9)
SOT-23-5_L2.9-W1.6-P0.95-LS2.8-BL
  rect 0.6x1 smd: 1(-0.95,-1.1) 2(0,-1.1) 3(0.95,-1.1) 4(0.95,1.1) 5(-0.95,1.1)
SW-SMD_L6.0-W3.3-LS8.0
  rect 1.9x1.5 smd: 1(-4,0) 2(4,0)
SW-TH_SK-12D02-VG5
  oval 1.4x1.1 hole 0.9x0.7: 1(-2,0) 2(0.001,0) 3(2,0)
  oval 1.2x2 hole 0.7x1.5: 4(4.1,0) 5(-4.1,0)
TSSOP-16_L5.0-W4.4-P0.65-LS6.4-BL
  oval 0.343x1.732 smd: 1(-2.275,-2.866) 2(-1.625,-2.866) 3(-0.975,-2.866) 4(-0.325,-2.866) 5(0.325,-2.866) 6(0.975,-2.866) 7(1.625,-2.866) 8(2.275,-2.866) 9(2.275,2.866) 10(1.625,2.866) 11(0.975,2.866) 12(0.325,2.866) 13(-0.325,2.866) 14(-0.975,2.866) 15(-1.625,2.866) 16(-2.275,2.866)
USB-C-SMD_TYPE-C-6PIN-2MD-073
  rect 0.55x1.1 smd: 1(-3.2,2.375) 2(-2.4,2.375) 11(2.4,2.375) 12(3.2,2.375)
  rect 0.3x1.1 smd: 3(-1.75,2.375) 4(-1.25,2.375) 5(-0.75,2.375) 6(-0.25,2.375) 7(0.25,2.375) 8(0.75,2.375) 9(1.25,2.375) 10(1.75,2.375)
  oval 1.2x1.8 hole 0.6x1.2: 13(-4.325,-2.375) 14(4.325,-2.375)
  oval 1.1x2 hole 0.6x1.5: 13(-4.325,1.825) 14(4.325,1.825)
WIFIM-SMD_39P-L25.5-W18.0-P1.27
  rect 2.4x0.9 smd: 1(-8.7,8.965) 2(-8.7,7.695) 3(-8.7,6.425) 4(-8.7,5.155) 5(-8.7,3.885) 6(-8.7,2.615) 7(-8.7,1.345) 8(-8.7,0.075) 9(-8.7,-1.195) 10(-8.7,-2.465) 11(-8.7,-3.735) 12(-8.7,-5.005) 13(-8.7,-6.275) 14(-8.7,-7.545) 25(8.7,-7.545) 26(8.7,-6.275) 27(8.7,-5.005) 28(8.7,-3.735) 29(8.7,-2.465) 30(8.7,-1.195) 31(8.7,0.075) 32(8.7,1.345) 33(8.7,2.615) 34(8.7,3.885) 35(8.7,5.155) 36(8.7,6.425) 37(8.7,7.695) 38(8.7,8.965)
  rect 0.9x2.4 smd: 15(-5.715,-8.965) 16(-4.445,-8.965) 17(-3.175,-8.965) 18(-1.905,-8.965) 19(-0.635,-8.965) 20(0.635,-8.965) 21(1.905,-8.965) 22(3.175,-8.965) 23(4.445,-8.965) 24(5.715,-8.965)
  rect 5x5 smd: 39(-1.017,1.422)

## Nets
As in the schematic.

Pads without a net: D1 5; SW1 1; U3 4; U5 2 3 4 5 6 7 12 14 15 16 17 19 21 22; U8 18; U10 4 5 6 7 8 9 10 16 17 18 19 20 21 22 26 27 28 29 30 31 32 36 37; U11 8 9 13 14; USB1 3 9

## Via types
v1: diameter 0.61, hole 0.305, Top Layer to Bottom Layer, 52 vias
v2: diameter 0.5, hole 0.3, Top Layer to Bottom Layer, 1 via
v3: diameter 0.508, hole 0.299, Top Layer to Bottom Layer, 1 via
v4: diameter 0.508, hole 0.305, Top Layer to Bottom Layer, 1 via

## Routing (per net, layer and track width the routed paths; a pad name or vN(x,y) marks a point on that pad's centre or on a via; arc(x,y) is an arc through that point)
GND: length 28
  Top Layer w0.254: R33.2 7.71,31.03 v1(7.71,32.16) ; U5.25 66.55,18.43 U5.1 ; U5.25 68.56,20.44 U5.11 70.93,20.44 C9.1 ; U5.25 68.06,19.44 U5.9 ; U5.25 66.56,20.94 U5.18 ; U8.10 79.21,12.91 79.92,12.2 ; 9.44,43.29 10.8,44.65 v1(10.8,46.34) ; 77.37,13.8 78.02,13.8 ; 77.37,13.8 78.95,12.22 ; 77.37,13.8 76.72,13.8 ; 80.52,9.88 80.52,8.07 79.32,8.07 ; 81.16,12.34 U8.7 U8.6
  vias: v1(7.4,30.66) v1(7.53,41.89) v1(11.48,41.77) v1(18.66,20.76) v1(26.71,9.71) v1(42.95,21.76) v1(67.81,18.63) v1(71.68,17.16) v1(86.59,45.09) v1(88.03,38.85) v1(88.34,50.66) v1(92.47,34.91) v1(92.47,32.19)
V5+: length 116.3
  Top Layer w0.381: D2.1 19.17,18.82 19.17,15 20.01,14.16 25.09,14.16 v1(29.48,9.77)
  Top Layer w0.508: R4.2 R3.2 ; R3.2 95.92,32.83 U12.2 95.15,33.28 C5.2 87.79,33.28 86.2,31.69 U3.5 86.2,26.79 v1(82.34,22.92) ; R3.2 R37.2 ; v1(20.97,20.76) 18.81,22.92 C28.1
  Bottom Layer w0.508: v1(29.48,9.77) 32.68,12.97 83,12.97 84.5,14.46 84.5,20.76 v1(82.34,22.92)
V12-EN: length 92.1
  Top Layer w0.254: 89.88,11.48 C23.2
  Top Layer w0.508: 83.13,16.22 v1(83.13,14.26) 83.11,14.24 U8.4 ; 83.13,16.22 82.94,16.4 79.25,16.4 78.56,15.71 U8.11 ; 83.13,16.22 83.13,16.23 ; v1(33.19,13.83) 32.45,14.57 U13.2 31.33,14.01 29.36,14.01 R39.2 ; C24.2 89.88,11.48 89.89,11.49 C26.1 90.36,13.8 91.03,14.46 91.03,15.53 89.76,16.8 83.69,16.8 83.13,16.23 ; 83.13,16.23 80.31,19.05 80.8,19.05 81.22,19.46 81.22,20.64 80.91,20.95 80.31,20.95
  Bottom Layer w0.508: v1(33.19,13.83) 38.73,19.37 81.04,19.37 82.57,17.84 82.57,14.82 v1(83.13,14.26)
VBUS: length 17.5
  Top Layer w0.508: v1(91.1,36.03) 92.44,36.03 92.47,36 95.04,36 U12.1
  Bottom Layer w0.508: 86.83,41.25 86.83,38.67 89.48,36.03 v1(91.1,36.03) ; 86.83,41.25 v1(86.83,44.33) ; 86.83,41.25 v1(88.32,39.77)
VCC3.3: length 78.6
  Top Layer w0.254: 69.05,21.95 69.05,22.2
  Top Layer w0.381: U5.8 70.5,18.94 71.25,18.18 71.28,18.18 ; v1(44.22,4.51) 44.22,1.53 ; 44.22,1.53 C1.2 ; 44.22,1.53 46.54,1.53 C2.1 ; 71.28,18.18 C11.1 C8.1 R38.2 76.35,18.18 77.22,19.05 78.11,19.05 77.15,20.01 73.49,20.01 72.87,20.64 72.87,21.73 72.13,22.47 69.56,22.47 69.05,21.95 U5.13 ; 71.28,18.18 69.8,16.7 R5.2 64,15.15 64.61,14.54 63.98,13.91 63.98,9.56 64.66,8.88 v1(65.5,8.88) ; 69.05,22.2 68.73,22.52 62.45,22.52 61.89,21.96 61.89,20.56 62.27,20.18 63.59,20.18 R6.2
  Bottom Layer w0.254: v1(65.5,8.88) 47.62,8.88 44.22,5.48 v1(44.22,4.51)
BAT+: length 75.2
  Top Layer w0.381: R34.2 10.07,14.98 Q2.1 Q2.2 Q2.3
  Top Layer w0.508: 15.51,59.72 15.51,58.61 13.53,56.63 13.53,56.07 7.71,50.25 R40.2 7.69,48.69 R42.1 6.24,43.29 6.24,41.46 7.5,40.21 U11.16 7.5,39.06 3.78,35.34 3.78,21.2 7.08,17.89 7.08,14.03 7.57,13.54 7.97,13.54 9.39,12.12 Q2.3 ; C32.2 4.92,27.13 4.92,21.88 8.83,17.98 R34.2
CC1: length 12.6
  Top Layer w0.152: D1.4 90.18,50.01 91.87,48.32 91.87,43.17 89.63,40.93 88.03,40.93 USB1.4
CC2: length 7.6
  Top Layer w0.203: D1.3 88.44,50.01 89.1,49.35 89.1,45.22 87.8,43.92 87.51,43.92 87.31,43.72
D+: length 21.9
  Top Layer w0.152: USB1.6 87.39,41.81 87.01,41.43 87.01,38.79 90.01,35.79 U3.1
  Top Layer w0.203: v4(88.89,44.03) 87.63,42.76 USB1.8 ; v2(87.44,50.76) 87.99,51.31 D1.1 ; v3(88.92,41.97) 87.83,41.97
  Bottom Layer w0.203: v3(88.92,41.97) 88.92,44 v4(88.89,44.03) 88.89,48.88 87.44,50.33 v2(87.44,50.76)
D-: length 22.8
  Top Layer w0.152: U3.2 88.74,36.7 86.75,38.69 86.75,41.82 87.23,42.29 USB1.7 87.73,42.29 87.88,42.44 88.35,42.44 89.4,43.5 89.4,41.77 89.07,41.44 87.91,41.44 USB1.5 ; D1.6 89.44,51.31 89.12,50.99 89.15,50.96 89.15,49.77 89.4,49.52 89.4,43.51
D_EN: length 35.2
  Top Layer w0.254: 82.46,6.61 U8.24 ; 82.46,6.61 83.45,6.61 83.76,6.92 U8.26 ; 82.46,6.61 81.56,6.61 81.16,7.01 U8.22
  Bottom Layer w0.254: v1(55.65,4.51) 55.65,4.95 58.97,8.27 80.54,8.27 v1(81.16,8.89)
D_PWM_U: length 27.1
  Bottom Layer w0.508: v1(84.41,8.39) 82.59,6.56 60.65,6.56 59.46,5.38 v1(59.46,4.51)
D_PWM_V: length 27
  Bottom Layer w0.508: v1(83.11,8.39) 81.89,7.17 60.09,7.17 58.19,5.28 v1(58.19,4.51)
D_PWM_W: length 26.9
  Bottom Layer w0.508: v1(56.92,4.51) 56.92,5.23 59.48,7.78 81.2,7.78 v1(81.81,8.39)
E-EN: length 27.9
  Top Layer w0.508: 45.49,4.51 45.49,3.05 45.97,2.58 62.78,2.58 65.45,5.24 RESET.1 65.51,7.87 65.5,7.88 67.87,7.88 67.92,7.83
IO0: length 51.2
  Top Layer w0.254: 65.51,14.54 BOOT.1
  Top Layer w0.381: v1(58.36,16.34) 54.75,19.95 42.34,19.95 41.96,20.33 41.96,23.35 42.34,23.74 59.33,23.74 59.46,23.6 v1(59.46,21.91)
  Bottom Layer w0.381: v1(65.42,14.54) 63.61,16.34 v1(58.36,16.34)
P_ADC: length 54.1
  Top Layer w0.254: v1(8.57,41.89) 8.56,41.91 R42.2
  Bottom Layer w0.254: v1(8.57,41.89) 8.57,38.01 24,22.59 48.99,22.59 v1(49.37,22.21)
RXD0: length 60.2
  Top Layer w0.254: v1(88.74,31.56) U3.7 88.74,26.15 89.98,24.9 95.42,24.9 96.03,25.51 TTL.1
  Bottom Layer w0.254: v1(48.02,21.7) 48.4,21.32 77.12,21.32 86.63,30.83 86.63,31.53 87.24,32.14 88.16,32.14 v1(88.74,31.56)
SCL0: length 5.2
  Top Layer w0.254: U10.23 65.01,17.65 U5.24
SDA0: length 4.9
  Top Layer w0.254: U10.24 65.78,18.92 U5.23
TXD0: length 62
  Top Layer w0.254: v1(87.5,31.56) 87.47,31.53 U3.6 87.47,26.91 89.83,24.55 96.34,24.55 96.88,25.09 TTL.3
  Bottom Layer w0.254: v1(87.5,31.56) 87.5,30.97 77.36,20.84 47.08,20.84 v1(46.78,21.14)
U: length 13.4
  Top Layer w0.254: U8.5 82.46,14.9 v1(81.86,15.51)
  Bottom Layer w0.381: CN1.1 72.65,14.6 73.53,13.73 80.64,13.73 81.86,14.95 v1(81.86,15.51)
V: length 11
  Top Layer w0.254: v1(80.82,15.51) 80.51,15.19 U8.8
  Bottom Layer w0.381: v1(80.82,15.51) 80.82,14.95 80.09,14.21 74.06,14.21 73.45,14.82 CN1.2
W: length 7.8
  Top Layer w0.254: U8.9 79.86,15.49 v1(79.88,15.51)
  Bottom Layer w0.381: v1(79.88,15.51) 79.06,14.69 75.36,14.69 CN1.3
$1N4426: length 3.2
  Top Layer w0.254: C6.1 91.85,28.87 91.05,28.87 U3.8
$1N4742: length 2.2
  Top Layer w0.254: R3.1 95.92,27.57 TTL.2
$1N4768: length 2.4
  Top Layer w0.254: R4.1 97.48,28.05 TTL.4
$1N6012: length 1.9
  Top Layer w0.254: U5.10 71.52,19.94 C9.2
$1N6344: length 2.2
  Top Layer w0.254: U5.20 65.27,20.44 64.56,21.15 C10.1
$1N6735: length 3.2
  Top Layer w0.254: 78.11,20.95 76.24,22.82 C12.1
$1N10947: length 3.4
  Top Layer w0.254: 76.72,8.07 77.95,8.07 77.95,5.99 78.02,5.92
$1N11170: length 2.4
  Top Layer w0.254: 85.17,13.8 C25.2
$1N11174: length 4.5
  Top Layer w0.254: 84.41,14.15 84.41,15.06 84.75,15.4 87.09,15.4 87.61,14.89
$1N11246: length 7.7
  Top Layer w0.254: U8.3 83.76,15.12 84.4,15.76 89.02,15.76 89.89,14.89
$1N21068: length 8.2
  Top Layer w0.381: R26.1 30.35,5.25 29.13,4.03 Q1.4
$1N21616: length 10.3
  Top Layer w0.381: Q3.6 Q3.7 Q3.8 ; Q3.6 Q3.5 ; Q3.6 16.75,9.97 Q2.5 Q2.6 Q2.7 Q2.8
$1N22205: length 3.2
  Top Layer w0.381: Q2.4 11.89,9.03 R29.1
$1N22284: length 17
  Top Layer w0.254: 8.15,33.98 8.15,35.24 v1(7.89,35.5)
  Bottom Layer w0.254: v1(11.47,44.69) 8.86,44.69 6.27,42.1 6.27,35.04 6.55,34.76 7.03,34.76 7.77,35.5 v1(7.89,35.5)
$1N22287: length 26.8
  Bottom Layer w0.254: v1(8.8,33.94) 8.8,13.55 v1(13.32,9.03)
$1N22338: length 2.2
  Top Layer w0.254: R30.2 9.45,33.03 9.45,33.98
$1N22413: length 3.6
  Top Layer w0.254: C30.2 10.1,31.57 10.1,33.98
$1N22416: length 3.2
  Top Layer w0.254: 10.75,33.98 10.75,32.41 11.3,31.86 12.05,31.86 C31.2
$1N22526: length 13.2
  Top Layer w0.254: U11.10 11.4,38.85 10.69,38.14 7.82,38.14 5.36,35.69 R31.2
$1N22587: length 2.1
  Top Layer w0.254: 10.75,41.85 U11.11
$1N22677: length 28.5
  Top Layer w0.254: R33.1 R31.1 ; R33.1 7.4,28.52 C32.1 ; R33.1 9.46,29.85 C30.1 12.39,30.71 12.87,31.19 12.87,32.17 12.49,32.55 12.1,32.55 11.4,33.26 11.4,36.84 12.82,38.26 12.82,41.92 12.18,42.56 10.03,42.56 9.62,42.15 9.62,41.18 10.1,40.7 U11.12
  Top Layer w0.381: 12.07,30.71 C31.1
$1N22806: length 28.2
  Top Layer w0.254: R34.1 7.96,17.85 4.26,21.55 4.26,35.14 8.15,39.03 U11.15
  Top Layer w0.381: C33.1 7.97,16.22 R34.1
$1N23187: length 58.1
  Top Layer w0.381: BAT_Reset.1 12.33,47.57 R28.1 R27.1 13.73,41.82 13.73,23.2 18.43,18.5 18.43,14.87 19.63,13.68 24.27,13.68 25.37,12.58 25.37,10.55 24.78,9.97 Q3.3 Q3.2 Q3.1 26.15,5.3 Q1.3 Q1.2 Q1.1
$1N23372: length 39.4
  Top Layer w0.508: Q1.5 Q1.6 Q1.7 Q1.8 34.08,8.9 34.08,21.32 33.09,22.31 29.56,22.31 SW1.2 26.38,22.24 22.75,22.24 22.37,21.86 22.37,18.27 C29.1 21.85,15.68 D2.2
$1N23637: length 47.6
  Top Layer w0.254: v1(6.85,35.5) 7.5,34.85 7.5,33.98
  Bottom Layer w0.254: 6.85,35.7 7.89,36.74 8.78,36.74 9.7,35.83 9.7,25.57 v1(24.03,11.24) ; 6.85,35.7 6.85,42.1 7.97,43.22 v1(11.47,43.22) ; 6.85,35.7 v1(6.85,35.5)
$1N23749: length 2
  Top Layer w0.254: V5+.2 94.2,27.81 R37.1
$1N23775: length 2.9
  Top Layer w0.254: R38.1 78.59,17.32 V3.3.2
$1N23930: length 1.5
  Top Layer w0.254: 28.52,14.09 28.52,15.58
$1N24036: length 2.6
  Top Layer w0.254: R40.1 9.2,48.08 BAT.2
$1N25830: length 8.1
  Top Layer w0.508: U13.1 31.88,17.83 30.8,18.91 27.71,18.91 SW1.3

## Copper pours and planes (outline as drawn; the poured copper is in the pictures)
GND on Top Layer: -2.94,103.64 103.45,103.64 103.45,-5.14 -2.94,-5.14
GND on Bottom Layer: -3.46,103.62 103.55,103.62 103.55,-5.73 -3.46,-5.73
